# Altium schematic sheet LIFT_CARD.SchDoc
size A4
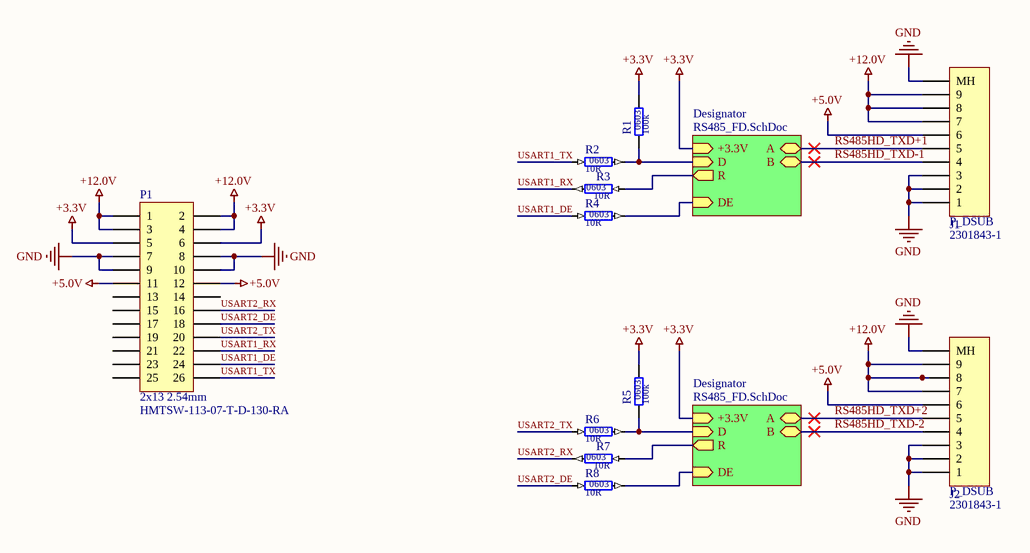
[diagram p0: LIFT_CARD.SchDoc]

## Parts
J1  value 2301843-1  SCH_Footprint: P_DSUB  [P_DSUB_2301843-1]  (hidden comment: DSUB 9 Pin)
J2  value 2301843-1  SCH_Footprint: P_DSUB  [P_DSUB_2301843-1]  (hidden comment: DSUB 9 Pin)
P1  value HMTSW-113-07-T-D-130-RA  SCH_Footprint: 2x13 2.54mm  [P_HEADER_2x13_2.54_RIGHT_ANGLE]  (hidden comment: Goldpin male)
R1  value 100k  SCH_Footprint: 0603  [R_0603_1608]  (hidden comment: Resistor)
R2  value 10R  SCH_Footprint: 0603  [R_0603_1608]  (hidden comment: Resistor)
R3  value 10R  SCH_Footprint: 0603  [R_0603_1608]  (hidden comment: Resistor)
R4  value 10R  SCH_Footprint: 0603  [R_0603_1608]  (hidden comment: Resistor)
R5  value 100k  SCH_Footprint: 0603  [R_0603_1608]  (hidden comment: Resistor)
R6  value 10R  SCH_Footprint: 0603  [R_0603_1608]  (hidden comment: Resistor)
R7  value 10R  SCH_Footprint: 0603  [R_0603_1608]  (hidden comment: Resistor)
R8  value 10R  SCH_Footprint: 0603  [R_0603_1608]  (hidden comment: Resistor)

## Sub-sheets
Designator = RS485_FD.SchDoc: +3.3V (in), R (out), D (in), DE (in), A (bidir), B (bidir)
Designator = RS485_FD.SchDoc: +3.3V (in), R (out), D (in), DE (in), A (bidir), B (bidir)

## Nets
+3.3V: P1.5 P1.6 R1.2 R5.2 ; sheet Designator/+3.3V, sheet Designator/+3.3V
+5.0V: J1.6 J2.6 P1.11 P1.12
+12.0V: J1.7 J1.8 J1.9 J2.7 J2.8 J2.9 P1.1 P1.2 P1.3 P1.4
GND: J1.1 J1.2 J1.3 J1.MH J2.1 J2.2 J2.3 J2.MH P1.7 P1.8 P1.9 P1.10
RS485HD_TXD+1: J1.5 ; sheet Designator/A
RS485HD_TXD+2: J2.5 ; sheet Designator/A
RS485HD_TXD-1: J1.4 ; sheet Designator/B
RS485HD_TXD-2: J2.4 ; sheet Designator/B
USART1_DE: P1.24 R4.1
USART1_RX: P1.22 R3.2
USART1_TX: P1.26 R2.1
USART2_DE: P1.18 R8.1
USART2_RX: P1.16 R7.2
USART2_TX: P1.20 R6.1
NetR1_1: R1.1 R2.2 ; sheet Designator/D
NetR3_1: R3.1 ; sheet Designator/R
NetR4_2: R4.2 ; sheet Designator/DE
NetR5_1: R5.1 R6.2 ; sheet Designator/D
NetR7_1: R7.1 ; sheet Designator/R
NetR8_2: R8.2 ; sheet Designator/DE

Not connected (* = marked no-connect by the designer): P1 13 14 15 17 19 21 23 25

## Library data of the parts
J1 J2 = P_DSUB_2301843-1: Header, 9-Pin; Manufacturer: TE Conectivity; Part Number: P_DSUB_2301843-1; HelpURL: https://pl.mouser.com/datasheet/2/418/1/NG_CD_2301843_H-1517790.pdf; Manufacturer Part Number: 2301843-1; Supplier 1: TME; Supplier 2: RS Components; Supplier 3: Farnell; Supplier Part Number 3: 2857982; Supplier 4: Mouser; Supplier Part Number 4: 571-2301843-1; Supplier 5: Digi-Key; Supplier Part Number 5: A132510-ND; Supplier 6: LCSC
P1 = P_HEADER_2x13_2.54_ANGLE: Pin Header; Manufacturer: Samtec; Part Number: P_HEADER_2x13_2.54_ANGLE; HelpURL: https://datasheet.octopart.com/HMTSW-113-07-T-D-130-RA-Samtec-datasheet-97080704.pdf; Manufacturer Part Number: HMTSW-113-07-T-D-130-RA; Supplier 1: TME; Supplier 2: RS Components; Supplier 3: Farnell; Supplier 4: Mouser; Supplier Part Number 4: 200-HMTSW1137TD130RA; Supplier 5: Digi-Key; Supplier Part Number 5: HMTSW-113-07-T-D-130-RA-ND; Supplier 6: LCSC
R1 R5 = R_100k_0603_1: Manufacturer: Royalohm; Manufacturer Part Number: 0603SAF1003T5E; Voltage: 50V; Power: 100mW; Tolerance: 1%; Part Number: R_100k_0603_1; HelpURL: http://www.tme.eu/pl/Document/b315665a56acbc42df513c99b390ad98/ROYALOHM-THICKFILM.pdf; Supplier 1: TME; Supplier Part Number 1: SMD0603-100K-1%; Supplier 2: RS Components; Supplier 3: Farnell; Supplier 4: Mouser; Supplier Part Number 4: 667-ERJ-3EKF1003V; Supplier 5: Digi-Key; Supplier Part Number 5: P100KHCT-ND; Supplier 6: LCSC
R2-R4 R6-R8 = R_10R_0603_1: Manufacturer: Royalohm; Manufacturer Part Number: 0603SAF100JT5E; Voltage: 50V; Power: 100mW; Tolerance: 1%; Part Number: R_10R_0603_1; HelpURL: http://www.tme.eu/pl/Document/b315665a56acbc42df513c99b390ad98/ROYALOHM-THICKFILM.pdf; Supplier 1: TME; Supplier Part Number 1: SMD0603-10R-1%; Supplier 2: RS Components; Supplier 3: Farnell; Supplier 4: Mouser; Supplier 5: Digi-Key